# EasyEDA Pro project ProPrj_MambaQuad_2026-04-23.epro, schematic Schematic1
Board Name: Board1; Create Date: 2026-01-16; Page Name: P1; Project Name: CuteQuadUAV; Schematic Name: Schematic1; Update Date: 2026-01-16; BladeWidth: 10; Company: CQUPT; Drawed: WilliTourt; Page Size: A2; RegionStart: 1; Reviewed: WilliTourt; ShowBorder: 1; TitleBlock: 1; TitleBlockPosition: 3; Version: V1.0; XRegionCount: 6; YRegionCount: 4
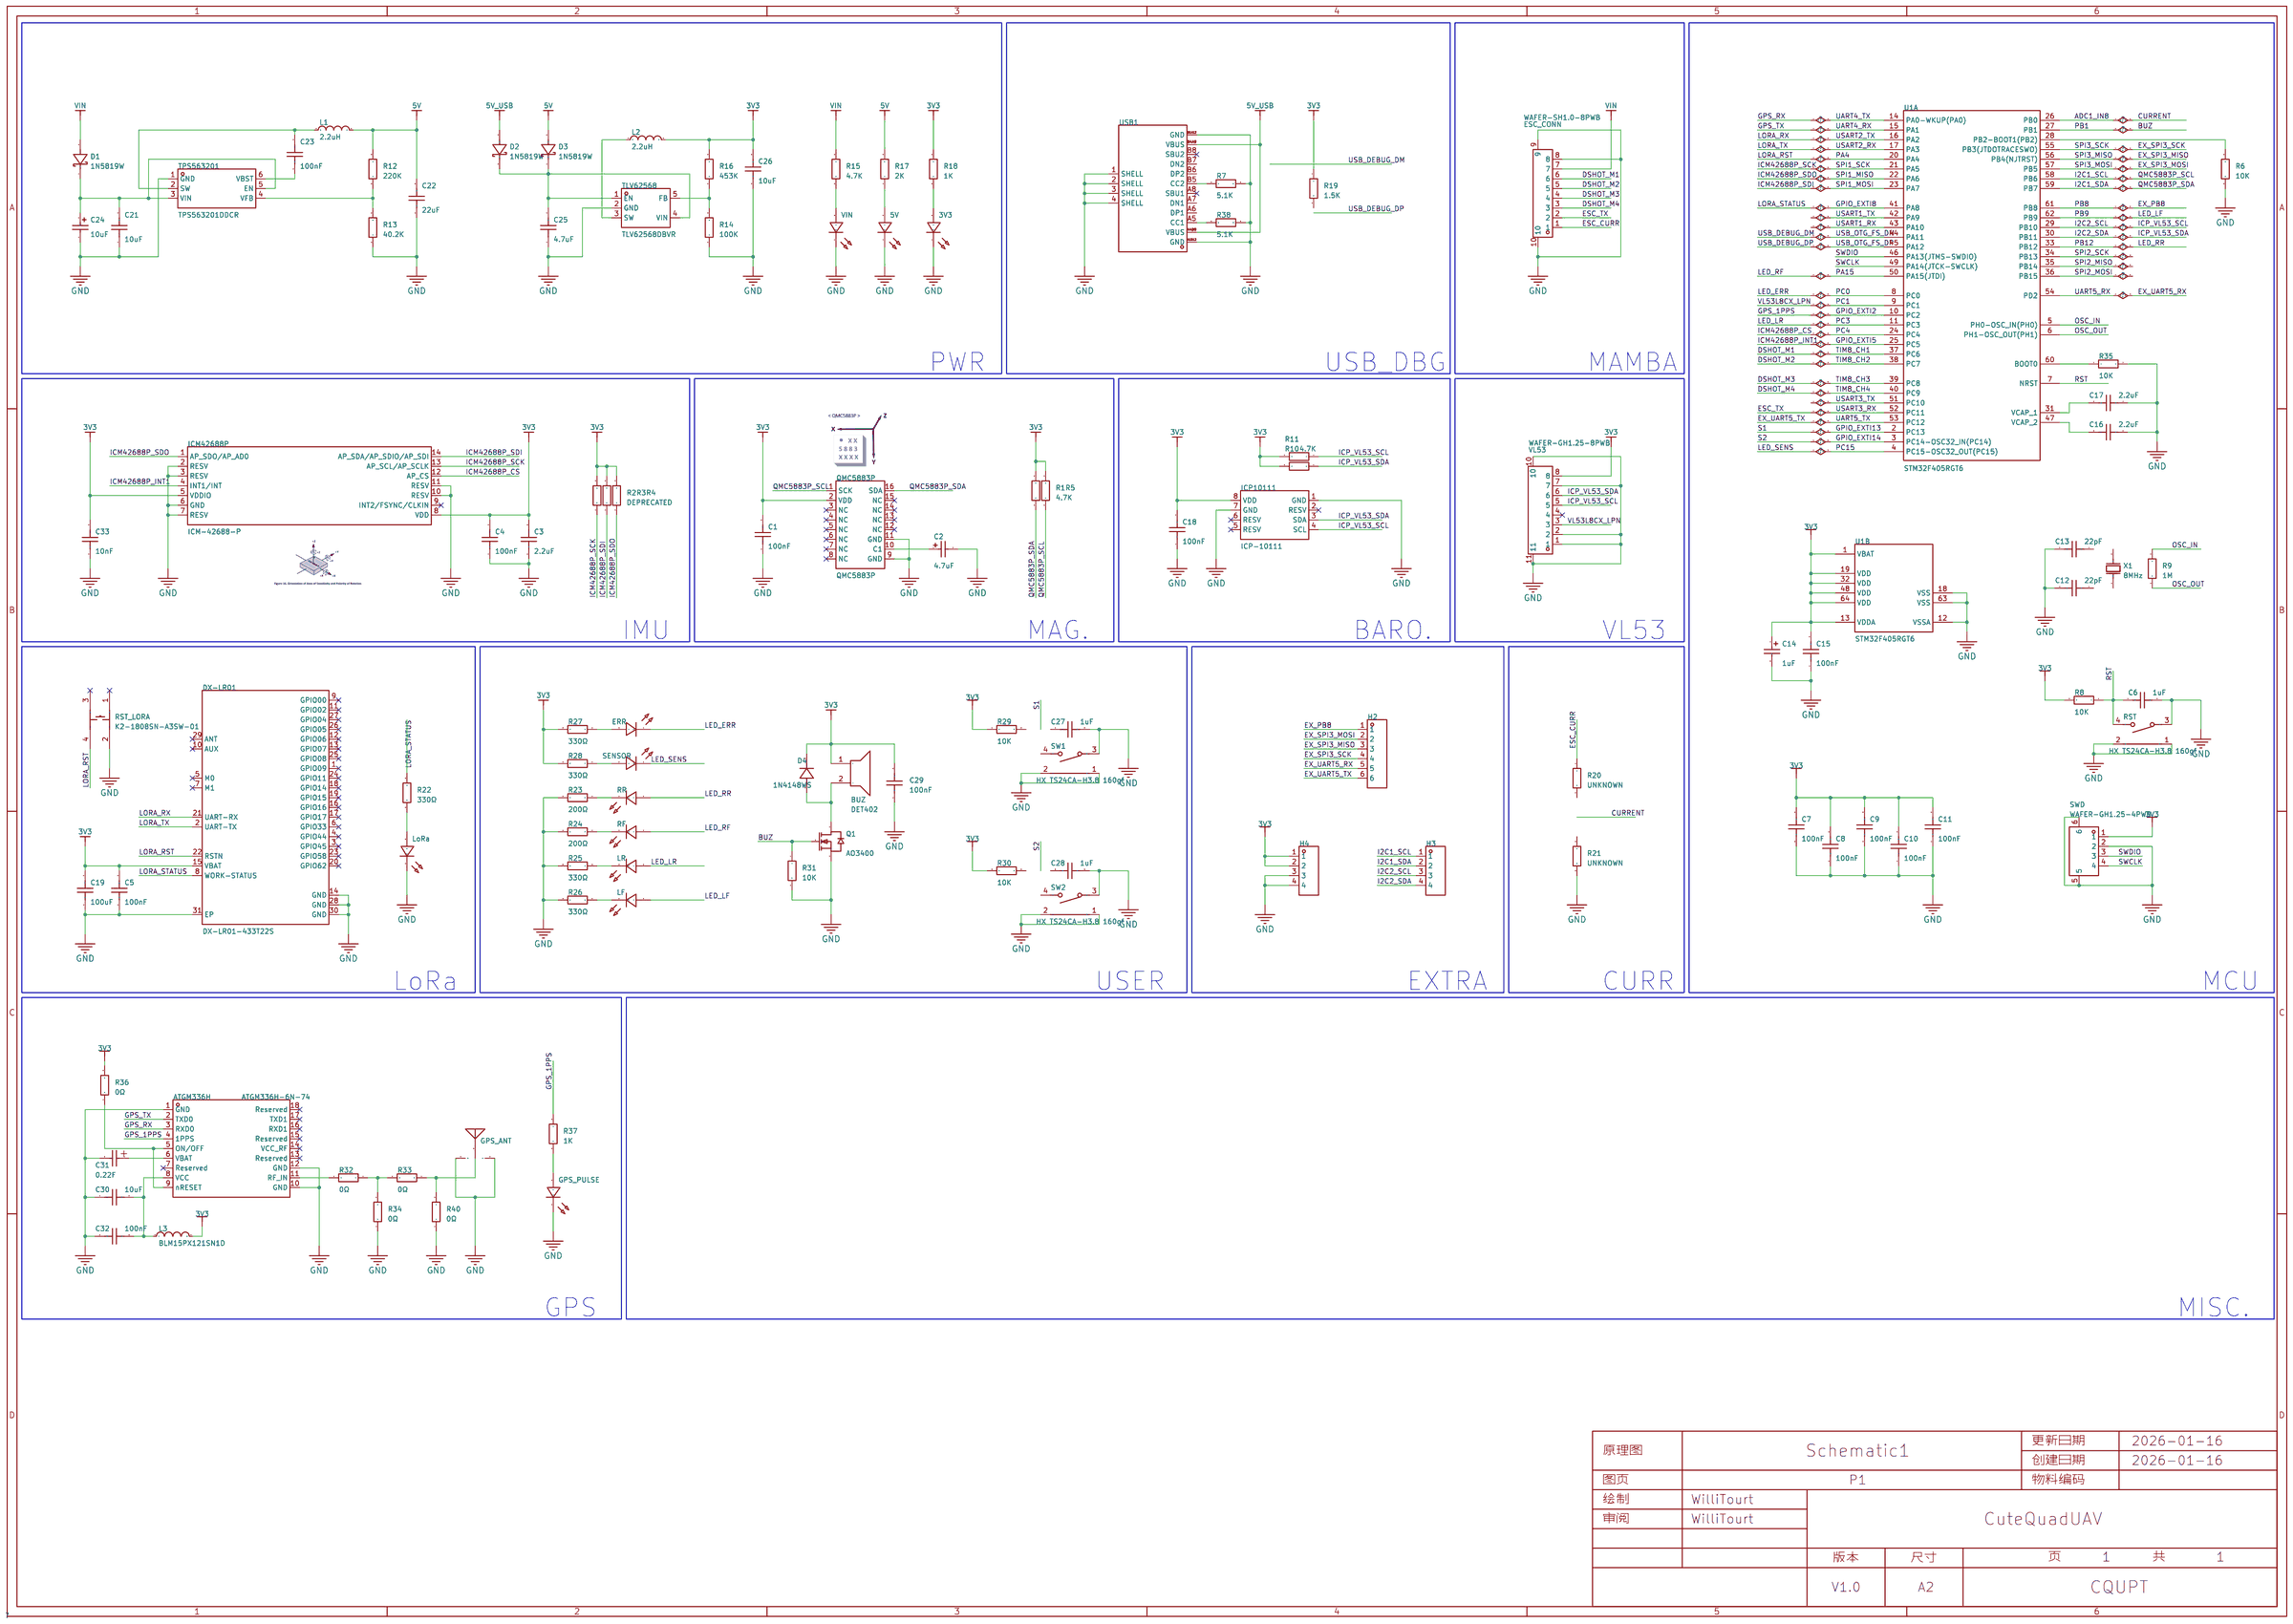
[diagram p2: schematic sheet]

## Parts
3V3  -  [LED0402]
5V  -  [LED0402]
ATGM336H  ATGM336H-6N-74  [COMM-SMD_18P-L10.1-W9.7-P1.1-TL_L76-LB]
BUZ  DET402  [BUZ-SMD_L4.0-W3.0-LS4.5-FD]
C1  100nF  [C0402]
C2  4.7uF  [CASE-A_3216]
C3  2.2uF  [C0402]
C4  100nF  [C0402]
C5  100nF  [C0603]
C6  1uF  [C0402]
C7  100nF  [C0402]
C8  100nF  [C0402]
C9  100nF  [C0402]
C10  100nF  [C0402]
C11  100nF  [C0402]
C12  22pF  [C0402]
C13  22pF  [C0402]
C14  1uF  [CASE-A_3216]
C15  100nF  [C0402]
C16  2.2uF  [C0402]
C17  2.2uF  [C0402]
C18  100nF  [C0402]
C19  100uF  [C1206]
C21  10uF  [C0603]
C22  22uF  [C0603]
C23  100nF  [C0603]
C24  10uF  [CAP-SMD_BD4.0-L4.3-W4.3-LS5.0-FD]
C25  4.7uF  [C0603]
C26  10uF  [C0603]
C27  1uF  [C0402]
C28  1uF  [C0402]
C29  100nF  [C0402]
C30  10uF  [C0603]
C31  0.22F  [CAP-TH_DMS3R3224]
C32  100nF  [C0402]
C33  10nF  [C0402]
D1  1N5819W  [SOD-123_L2.7-W1.6-LS3.7-RD]
D2  1N5819W  [SOD-123_L2.7-W1.6-LS3.7-RD]
D3  1N5819W  [SOD-123_L2.7-W1.6-LS3.7-RD]
D4  1N4148WS  [SOD-323_L1.7-W1.3-LS2.5-FD]
DX-LR01  DX-LR01-433T22S  [WIRELM-SMD_DX-LR01-433T22S]
ERR  -  [LED0402]
ESC_CONN  WAFER-SH1.0-8PWB  [CONN-SMD_8P-P1.00_XUNPU_WAFER-SH1.0-8PWB]
GPS_ANT  3GHz  [ANT-SMD_3P-L3.0-W2.6]
GPS_PULSE  -  [LED0402]
H2  -  [HDR-TH_6P-P2.54-V-F]
H3  -  [HDR-TH_4P-P2.54-V-F]
H4  -  [HDR-TH_4P-P2.54-V-F]
ICM42688P  ICM-42688-P  [LGA-14_L3.0-W2.5-P0.50-TL]
ICP10111  ICP-10111  [LGA-8_L2.5-W2.0-P0.65_AMP6127]
L1  2.2uH  [IND-SMD_L2.5-W2.0_MHCHL2520]
L2  2.2uH  [IND-SMD_L2.5-W2.0_MHCHL2520]
L3  BLM15PX121SN1D  [L0402]
LF  -  [LED0402]
LoRa  -  [LED0402]
LR  -  [LED0402]
Q1  AO3400  [SOT-23-3_L2.9-W1.3-P1.90-LS2.4-BL-2]
QMC5883P  QMC5883P  [LGA-16_L3.0-W3.0-P0.50-BL_SQ]
R1  4.7K  [R0402]
R2  DEPRECATED  [R0402]
R3  10K  [R0402]
R4  10K  [R0402]
R5  10K  [R0402]
R6  10K  [R0402]
R7  5.1K  [R0402]
R8  10K  [R0402]
R9  1M  [R0402]
R10  4.7K  [R0402]
R11  4.7K  [R0402]
R12  220K  [R0603]
R13  40.2K  [R0603]
R14  100K  [R0603]
R15  4.7K  [R0402]
R16  453K  [R0603]
R17  2K  [R0402]
R18  1K  [R0402]
R19  1.5K  [R0402]
R20  UNKNOWN  [R0402]
R21  UNKNOWN  [R0402]
R22  330Ω  [R0402]
R23  200Ω  [R0402]
R24  200Ω  [R0402]
R25  330Ω  [R0402]
R26  330Ω  [R0402]
R27  330Ω  [R0402]
R28  330Ω  [R0402]
R29  10K  [R0402]
R30  10K  [R0402]
R31  10K  [R0402]
R32  0Ω  [R0402]
R33  0Ω  [R0402]
R34  0Ω  [R0402]
R35  10K  [R0402]
R36  0Ω  [R0402]
R37  1K  [R0402]
R38  5.1K  [R0402]
R40  0Ω  [R0402]
RF  -  [LED0402]
RR  -  [LED0402]
RST  HX TS24CA-H3.8 160gf  [SW-SMD_TS24CA]
RST_LORA  K2-1808SN-A3SW-01  [SW-SMD_4P-L4.2-W3.3-P2.15-LS5.1]
SENSOR  -  [LED0402]
SW1  HX TS24CA-H3.8 160gf  [SW-SMD_TS24CA]
SW2  HX TS24CA-H3.8 160gf  [SW-SMD_TS24CA]
SWD  WAFER-GH1.25-4PWB  [CONN-SMD_4P-P1.25_XUNPU_WAFER-GH1.25-4PWB]
TLV62568  TLV62568DBVR  [SOT-23-5_L3.0-W1.7-P0.95-LS2.8-BR]
TPS563201  TPS563201DDCR  [SOT-23-6_L2.9-W1.6-P0.95-LS2.8-BR]
U1  STM32F405RGT6  [LQFP-64_L10.0-W10.0-P0.50-LS12.0-BL]  (sections 1,2)
USB1  Type-C-TOP_1  [USB-C-SMD_TYPE-C16PIN]
VIN  -  [LED0402]
VL53  WAFER-GH1.25-8PWB  [CONN-SMD_8P-P1.25_XUNPU-WAFER-GH1.25-8PWB]
X1  8MHz  [CRYSTAL-SMD_L5.0-W3.2]

## Library data of the parts
3V3 GPS_PULSE LoRa SENSOR = LED0402-WHITE
5V RF RR VIN = LED0402-GREEN
ATGM336H = ATGM336H-6N-74: ATGM336H-6N 系列模块是 10.1x9.7mm 尺寸的高性能 GNSS 全模定位导航模块系列的总称。基于中科微第六代多系统 GNSS SOC 单芯片 AT6668，支持多种卫星导航系统，包括北斗二号和北斗三号(B1I 和 B1C）、GALILEO、GPS/QZSS/SBAS、GLONASS 等，可同时接收卫星信号，实现联合定位、导航与授时。 支持同时接收全系统的卫星信号，基于专有的快速搜星技术，可快速接收大量可见卫星信号，实现快速且准确的定位，可显著改善如城市峡谷等复杂环境下的定位性能；集成高性; Supplier Part: C5804601; Manufacturer: 杭州中科微; Supplier Footprint: SMD,10.1x9.7mm; JLCPCB Part Class: 扩展库; Datasheet: https://item.szlcsc.com/datasheet/ATGM336H-6N-74/6733428.html; Supplier: LCSC
BUZ = DET402: Supplier Part: C2911630; Supplier Footprint: SMD; JLCPCB Part Class: 扩展库; Supplier: LCSC
C1 C3 C4 C6-C13 C15-C18 C27-C29 C32 C33 = C0402: Supplier Footprint: 0402
C2 = TAJA475K016RNJ: 容值:4.7uF;精度:±10%;额定电压:16V;等效串联电阻(ESR):4Ω@100kHz;; LCSC Part Name: 4.7uF ±10% 16V; Supplier Part: C7187; Manufacturer: Kyocera AVX; Supplier Footprint: CASE-A-3216-18(mm); JLCPCB Part Class: 扩展库; Supplier: LCSC; Tolerance: ±10%; Voltage Rating: 16V; Equivalent Series Resistance(ESR): 4Ω@100kHz; Operating Temperature: -55℃~+125℃
C5 C21-C23 C25 C26 C30 = C0603: Supplier Footprint: 0603
C14 = TAJA105K016RNJ: 容值:1uF;精度:±10%;额定电压:16V;等效串联电阻(ESR):11Ω;; LCSC Part Name: 1uF ±10% 16V; Supplier Part: C7174; Manufacturer: Kyocera AVX; Supplier Footprint: CASE-A-3216-18(mm); JLCPCB Part Class: 扩展库; Supplier: LCSC; Tolerance: ±10%; Voltage Rating: 16V; Equivalent Series Resistance(ESR): 11Ω; Operating Temperature: -55℃~+125℃
C19 = C1206: Supplier Footprint: 1206
C24 = VT10UF16V167RV0128: 容值:10uF;精度:±20%;额定电压:16V;纹波电流:18mA@120kHz;等效串联电阻:-;; LCSC Part Name: 10uF ±20% 16V; Supplier Part: C5246581; Manufacturer: KNSCHA(科尼盛); Supplier Footprint: SMD,D4xL5.4mm; JLCPCB Part Class: Extended Part; Datasheet: https://atta.szlcsc.com/upload/public/pdf/source/20221103/9F9BF07BB249386F3919A1DEC4ACBDCD.pdf; Supplier: LCSC; Tolerance: ±20%; Rated Voltage: 16V; Ripple Current: 18mA@120kHz; φD: 4mm; L: 5.4mm; Lifetime @ Temp: 2000hrs@105℃; Operating Temperature: -55℃~+105℃
C31 = DMS3R3224RS: 容值:0.22F;精度:-20%~+80%;额定电压:3.3V;漏电流:-;等效串联电阻(ESR):200Ω@1kHz;; LCSC Part Name: 0.22F -20%~+80% 3.3V; Supplier Part: C5110245; Manufacturer: KORCHIP(高奇普); Supplier Footprint: SMD,D6.8xL1.4mm; JLCPCB Part Class: 扩展库; Datasheet: https://atta.szlcsc.com/upload/public/pdf/source/20230629/D1B2554E63F39809F951A38373591E32.pdf; Supplier: LCSC; Tolerance: -20%~+80%; Voltage Rated: 3.3V; Equivalent Series Resistance(ESR): 200Ω@1kHz; Operating Temperature: -10℃~+60℃; Diameter: 6.8mm; Height - Seated(Max): 7.3mm
D1-D3 = 1N5819W_C963381: 二极管配置:独立式;正向压降(Vf):600mV@200mA;直流反向耐压(Vr):40V;整流电流:350mA;; LCSC Part Name: 电压:40V 电流:350mA; Supplier Part: C963381; Manufacturer: JSMSEMI(杰盛微); Supplier Footprint: SOD-123; JLCPCB Part Class: Extended Part; Datasheet: https://item.szlcsc.com/datasheet/1N5819W/1047092.html; Supplier: LCSC; Diode Configuration: 独立式; Voltage - Forward(Vf@If): 600mV@200mA; Voltage - DC Reverse(Vr): 40V; Current - Rectified: 350mA; Reverse Leakage Current (Ir): 5uA@30V; Non-Repetitive Peak Forward Surge Current: 13A
D4 = 1N4148WS_C7420319: 二极管配置:独立式;正向压降(Vf):1.25V@150mA;直流反向耐压(Vr):100V;整流电流:150mA;反向恢复时间(Trr):4ns;; Supplier Part: C7420319; Manufacturer: R+O(宏嘉诚); Supplier Footprint: SOD-323; JLCPCB Part Class: Extended Part; Datasheet: https://item.szlcsc.com/datasheet/1N4148WS/8397141.html; Supplier: LCSC; Diode Configuration: 独立式; Voltage - Forward(Vf@If): 1.25V@150mA; Voltage - DC Reverse(Vr): 100V; Current - Rectified: 150mA; Pd - Power Dissipation: 200mW; Reverse Leakage Current (Ir): 1uA@75V; Reverse Recovery Time (trr): 4ns; Operating Junction Temperature Range: -55℃~+150℃; Non-Repetitive Peak Forward Surge Current: 2A
DX-LR01 = DX-LR01-433T22S: Supplier Part: C9900235347; Supplier Footprint: SMD; Supplier: LCSC
ERR LF LR = LED0402-ORANGE
ESC_CONN = WAFER-SH1.0-8PWB: 插针结构:1x8P;间距:1mm;安装方式:卧贴;参考系列:SH;总PIN数:8P;排数:1;每排PIN数:8;行距:-;额定电流:1A;触头材质:黄铜;触头镀层:锡;工作温度:-40℃~+85℃;; LCSC Part Name: 1x8P 间距:1mm 卧贴 系列:SH; Supplier Part: C3029347; Manufacturer: XUNPU(讯普); Supplier Footprint: SMD,P=1mm,卧贴; JLCPCB Part Class: Extended Part; Datasheet: https://item.szlcsc.com/datasheet/WAFER-SH1.0-8PWB/3561359.html; Supplier: LCSC; Pins Structure: 1x8P; Pitch: 1mm; Mounting Type: 卧贴; Reference Series: SH; Number of Pins: 8P; Number of Rows: 1; Number of PINs Per Row: 8; Current Rating: 1A; Contact Material: 黄铜; Contact Plating: 锡; Operating Temperature: -40℃~+85℃; Voltage Rating: 50V; Plastic Material: LCP; Supplementary Features: 辅助焊脚; Color: 米色; Z-Height of the Board: 3.15mm; X-Length of Bottom Edge on Board (Spacing Line): 10.35mm; Y-Width of Bottom Edge on Board: 4.3mm
GPS_ANT = IPEX1-TXZ 142: 连接器类型:板端;接口类型:内针;端口数量:1;接口直径:2mm;接口长度/高度:1.25mm;频率:3GHz;射频系列:IPEX;阻抗:-;样式:-;工作温度:-40℃~+90℃;; LCSC Part Name: 内针 IPEX; Supplier Part: C3151745; Manufacturer: SHOU HAN(首韩); Supplier Footprint: SMD; JLCPCB Part Class: 扩展库; Datasheet: https://item.szlcsc.com/datasheet/IPEX1-TXZ%2520142/3712563.html; Supplier: LCSC; Connector Type: 板端; Interface: 内针; Number of Ports: 1; Interface Diameter: 2mm; Interface Length/Height: 1.25mm; RF Series: IPEX; Operating Temperature Range: -40℃~+90℃
H2 = HDR-F_2.54_1x6P: Supplier Part: C40877; Supplier Footprint: 插件
H3 H4 = HDR-F_2.54_1x4P: Supplier Part: C2718488; Supplier Footprint: 插件
ICM42688P = ICM-42688-P: 传感器类型:加速度计陀螺仪;; Supplier Part: C1850418; Manufacturer: TDK InvenSense(应美盛); Supplier Footprint: LGA-14(2.5x3); JLCPCB Part Class: 扩展库; Datasheet: https://atta.szlcsc.com/upload/public/pdf/source/20210703/CF24204867ACE5B754A2B035F23E5931.pdf; Supplier: LCSC; Sensor Type: 加速度计陀螺仪
ICP10111 = ICP-10111: 压力范围:30Kpa~110Kpa;; Supplier Part: C5772344; Manufacturer: TDK InvenSense(应美盛); Supplier Footprint: LGA-8(2x2.5); JLCPCB Part Class: Extended Part; Datasheet: https://item.szlcsc.com/datasheet/ICP-10111/6699212.html; Supplier: LCSC; Pressure range: 30Kpa~110Kpa; Voltage - Supply: 1.8V; Operating Temperature: -40℃~+85℃
L1 L2 = FTC252012S2R2MBCA: 电感值:2.2uH;精度:±20%;额定电流:3A;饱和电流(Isat):3.8A;类型:一体成型电感;; LCSC Part Name: 2.2uH ±20% 3.8A; Supplier Part: C5832372; Manufacturer: cjiang(长江微电); Supplier Footprint: 1008; JLCPCB Part Class: Extended Part; Datasheet: https://atta.szlcsc.com/upload/public/pdf/source/20230602/8FFEDA9C0247A92A0D4B67554BFE4091.pdf; Supplier: LCSC; Tolerance: ±20%; Rated Current: 3A; Saturation Current (Isat): 3.8A; DC Resistance (DCR): 55mΩ; Type: 一体成型电感
L3 = BLM15PX121SN1D: 阻抗@频率:120Ω@100MHz;误差:±25%;直流电阻(DCR):55mΩ;; LCSC Part Name: 单路 0402磁珠 阻抗120Ω@100MHz; Supplier Part: C88970; Manufacturer: muRata(村田); Supplier Footprint: 0402; JLCPCB Part Class: Extended Part; Datasheet: https://item.szlcsc.com/datasheet/BLM15PX121SN1D/90150.html; Supplier: LCSC; Impedance @ Frequency: 120Ω@100MHz; Tolerance: ±25%; DC Resistance(DCR): 55mΩ; Current Rating: 2A; Number of Circuits: 1; Operating Temperature: -55℃~+125℃
Q1 = AO3400: Supplier Part: C9900013365; Supplier Footprint: SOT-23; JLCPCB Part Class: 扩展库; Supplier: LCSC
QMC5883P = QMC5883P: QMC5883L停产，推荐使用 C2847467 QMC5883P替代; LCSC Part Name: 三轴磁传感器; Supplier Part: C2847467; Manufacturer: QST(上海矽睿); Supplier Footprint: LGA-16(3x3); JLCPCB Part Class: 扩展库; Datasheet: https://item.szlcsc.com/datasheet/QMC5883P/3044607.html; Supplier: LCSC
R1-R11 R15 R17-R38 R40 = R0402: Supplier Footprint: 0402
R12-R14 R16 = R0603: Supplier Footprint: 0603
RST SW1 SW2 = HX TS24CA-H3.8 160gf: 电路结构:单刀单掷;按钮形状:方形按钮;作用力:1.6N;安装方式:卧贴;开关长度:4.55mm;开关宽度:1.8mm;开关高度:3.8mm;带支架:不带支架;触点电流:50mA;额定电压:12V;带灯:无;工作寿命:2万次;; LCSC Part Name: 轻触开关2.3x4.7x3.8侧贴160gf带固定柱; Supplier Part: C25168830; Manufacturer: hanxia(韩下); Supplier Footprint: SMD-4P,4.6x1.8mm; JLCPCB Part Class: Extended Part; Datasheet: https://item.szlcsc.com/datasheet/HX%2520TS24CA-H3.8%2520160gf/26898572.html; Supplier: LCSC; Circuit: 单刀单掷; Actuator Style: 方形按钮; Operating Force: 1.6N; Mounting Type: 卧贴; Length: 4.55mm; Width: 1.8mm; Switch Height: 3.8mm; with Bracket: 不带支架; Contact Current: 50mA; Voltage Rating: 12V; Actuator/Cap Color: 黑色; With Lamp: 无; Termination Style: SMD接片; Life: 2万次; Operating Temperature: -25℃~+70℃
RST_LORA = K2-1808SN-A3SW-01: 作用力:180gf;安装方式:立贴;开关长度:4.2mm;开关宽度:3.25mm;开关高度:2.5mm;触点电流:50mA;额定电压(DC):12V;绝缘电阻:100MΩ;机械寿命:10万次;; LCSC Part Name: 3*4*2.5 贴片开关180G; Supplier Part: C2690012; Manufacturer: 韩国韩荣; Supplier Footprint: SMD; JLCPCB Part Class: 扩展库; Datasheet: https://atta.szlcsc.com/upload/public/pdf/source/20180927/C283535_7E7907F3E7B6C1691E1DC87E363D082A.pdf; Supplier: LCSC; Operating Force: 180gf; Mounting Style: 立贴; Switch Length: 4.2mm; Switch Width: 3.25mm; Switch Height: 2.5mm; Contact Current: 50mA; Voltage Rating (DC): 12V; Insulation Resistance: 100MΩ; Mechanical Life: 10万次; Operating Temperature: -25℃~+85℃
SWD = WAFER-GH1.25-4PWB: 插针结构:1x4P;间距:1.25mm;安装方式:卧贴;参考系列:GH;总PIN数:4P;排数:1;每排PIN数:4;行距:-;额定电流:1A;触头材质:黄铜;触头镀层:锡;工作温度:-25℃~+85℃;; LCSC Part Name: 1x4P 间距:1.25mm 卧贴 系列:GH; Supplier Part: C3029379; Manufacturer: XUNPU(讯普); Supplier Footprint: SMD,P=1.25mm,卧贴; JLCPCB Part Class: Extended Part; Datasheet: https://item.szlcsc.com/datasheet/WAFER-GH1.25-4PWB/3561391.html; Supplier: LCSC; Pins Structure: 1x4P; Pitch: 1.25mm; Mounting Type: 卧贴; Reference Series: GH; Number of Pins: 4P; Number of Rows: 1; Number of PINs Per Row: 4; Current Rating: 1A; Contact Material: 黄铜; Contact Plating: 锡; Operating Temperature: -25℃~+85℃; Voltage Rating: 125V; Plastic Material: LCP; Supplementary Features: 辅助焊脚; Color: 米色; Z-Height of the Board: 4.35mm; X-Length of Bottom Edge on Board (Spacing Line): 8.25mm; Y-Width of Bottom Edge on Board: 5mm
TLV62568 = TLV62568DBVR: 功能类型:降压型;输出类型:可调;工作电压:2.5V~5.5V;输出电压:600mV~5.5V;输出电流:1A;; LCSC Part Name: 1A高效同步降压转换器; Supplier Part: C163219; Manufacturer: TI(德州仪器); Supplier Footprint: SOT-23-5; JLCPCB Part Class: 扩展库; Datasheet: https://www.ti.com/cn/lit/gpn/tlv62568; Supplier: LCSC; Function: 降压型; Output Type: 可调; Input Voltage: 2.5V~5.5V; Output Voltage: 600mV~5.5V; Output Current: 1A; Switching Frequency: 1.5MHz; Operating Temperature: -40℃~+125℃@(TJ); Synchronous Rectification: 是; Number of Outputs: 1; Topology: 降压式; Switch tube (built-in/external): 内置
TPS563201 = TPS563201DDCR: 功能类型:降压型;输出类型:可调;工作电压:4.5V~17V;输出电压:768mV~7V;输出电流:3A;; LCSC Part Name: 4.5V至17V输入，3A同步降压电压调节器; Supplier Part: C116592; Manufacturer: TI(德州仪器); Supplier Footprint: SOT-23-THIN-6; JLCPCB Part Class: Extended Part; Datasheet: https://item.szlcsc.com/datasheet/TPS563201DDCR/117846.html; Supplier: LCSC; Function: 降压型; Output Type: 可调; Voltage - Supply: 4.5V~17V; Output Voltage: 768mV~7V; Output Current: 3A; Frequency - Switching: 580kHz; Operating Temperature: -40℃~+125℃@(TJ); Synchronous Rectifier: 是; Number of Outputs: 1; Topology: 降压式; Switch tube (built-in/external): 内置
U1 = STM32F405RGT6: CPU内核:ARM-M4;CPU最大主频:168MHz;应用领域:-;; LCSC Part Name: 带DSP和FPU的高性能基础系列ARM Cortex-M4 MCU，具有1 MB Flash、168 MHz CPU和ART加速器; Supplier Part: C15742; Manufacturer: ST(意法半导体); Supplier Footprint: LQFP-64(10x10); JLCPCB Part Class: 扩展库; Datasheet: https://item.szlcsc.com/datasheet/STM32F405RGT6/16424.html; Supplier: LCSC; CPU Core: ARM-M4; CPU Maximum Speed: 168MHz; Program Storage Size: 1MB; Program Memory Type: FLASH; Number of I/O: 51; ADC (Bit): 12bit; DAC (Bit): 12bit; Voltage - Supply: 1.8V~3.6V
USB1 = Type-C-TOP_1: Supplier Part: C9900005857; Supplier Footprint: Type-C16P; JLCPCB Part Class: 扩展库; Supplier: LCSC; Check: false
VL53 = WAFER-GH1.25-8PWB: 插针结构:1x8P;间距:1.25mm;安装方式:卧贴;参考系列:GH;总PIN数:8P;排数:1;每排PIN数:8;行距:-;额定电流:1A;触头材质:黄铜;触头镀层:锡;工作温度:-25℃~+85℃;; LCSC Part Name: 1x8P 间距:1.25mm 卧贴 系列:GH; Supplier Part: C3029383; Manufacturer: XUNPU(讯普); Supplier Footprint: SMD,P=1.25mm,卧贴; JLCPCB Part Class: Extended Part; Datasheet: https://item.szlcsc.com/datasheet/WAFER-GH1.25-8PWB/3561395.html; Supplier: LCSC; Pins Structure: 1x8P; Pitch: 1.25mm; Mounting Type: 卧贴; Reference Series: GH; Number of Pins: 8P; Number of Rows: 1; Number of PINs Per Row: 8; Current Rating: 1A; Contact Material: 黄铜; Contact Plating: 锡; Operating Temperature: -25℃~+85℃; Voltage Rating: 125V; Plastic Material: LCP; Supplementary Features: 辅助焊脚; Color: 米色; Z-Height of the Board: 4.35mm; X-Length of Bottom Edge on Board (Spacing Line): 13.25mm; Y-Width of Bottom Edge on Board: 5mm
X1 = X50328MSB2GI: 晶振类型:贴片晶振;频率:8MHz;常温频差:±10ppm;外接负载电容:20pF;频率稳定度(全温):±20ppm;; LCSC Part Name: 8MHz ±10ppm 20pF YSX530GA; Supplier Part: C115962; Manufacturer: YXC(扬兴晶振); Supplier Footprint: SMD5032; JLCPCB Part Class: 基础库; Datasheet: https://atta.szlcsc.com/upload/public/pdf/source/20240329/44922B0AF7B60E58E9B66993B6077277.pdf; Supplier: LCSC; Crystal Type: 贴片晶振; Normal temperature Frequency Tolerance: ±10ppm; External load capacitor: 20pF; Frequency Stability(Full temperature range): ±20ppm; Operating Temperature: -40℃~+85℃

## Nets
3V3: BUZ.1(+) C1.2 C3.2 C4.2 C5.2 C7.2 C8.2 C9.2 C10.2 C11.2 C14.1 C15.2 C18.2 C19.2 C26.2 C29.2 C33.2 D4.2(K) DX-LR01.15(VBAT) H4.1 H4.2 ICM42688P.5(VDDIO) ICM42688P.8(VDD) ICP10111.8(VDD) L2.2 L3.2 QMC5883P.2(VDD) R1.2 R2.2 R3.2 R4.2 R5.2 R8.2 R10.2 R11.2 R16.2 R18.1 R19.1 R27.2 R28.2 R29.1 R30.1 R36.2 SWD.1 U1.1(VBAT) U1.13(VDDA) U1.19(VDD) U1.32(VDD) U1.48(VDD) U1.64(VDD) VL53.8
5V: C22.2 D3.2(A) L1.2 R12.2 R17.2
5V_USB: D2.2(A) USB1.A4B9(VBUS) USB1.B4A9(VBUS)
GND: 3V3.1(C) 5V.1(C) ATGM336H.1(GND) ATGM336H.10(GND) ATGM336H.12(GND) C1.1 C2.2 C3.1 C4.1 C5.1 C6.2 C7.1 C8.1 C9.1 C10.1 C11.1 C12.2 C13.2 C14.2 C15.1 C16.1 C17.1 C18.1 C19.1 C21.1 C22.1 C24.2 C25.1 C26.1 C27.2 C28.2 C29.1 C30.1 C31.2 C32.1 C33.1 DX-LR01.14(GND) DX-LR01.28(GND) DX-LR01.30(GND) DX-LR01.31(EP) ESC_CONN.8 ESC_CONN.9 ESC_CONN.10 GPS_ANT.2 GPS_ANT.3 GPS_PULSE.1(C) H4.3 H4.4 ICM42688P.2(RESV) ICM42688P.3(RESV) ICM42688P.6(GND) ICM42688P.7(RESV) ICM42688P.10(RESV) ICM42688P.11(RESV) ICP10111.1(GND) ICP10111.7(GND) LoRa.1(C) Q1.2(S) QMC5883P.9(GND) QMC5883P.11(GND) R6.2 R7.2 R13.1 R14.1 R21.2 R23.2 R24.2 R25.2 R26.2 R31.2 R34.1 R35.2 R38.1 R40.1 RST.1 RST.2 RST.3 RST_LORA.2 SW1.1 SW1.2 SW1.3 SW2.1 SW2.2 SW2.3 SWD.2 SWD.5 SWD.6 TLV62568.2(GND) TPS563201.1(GND) U1.12(VSSA) U1.18(VSS) U1.63(VSS) USB1.1(SHELL) USB1.2(SHELL) USB1.3(SHELL) USB1.4(SHELL) USB1.A1B12(GND) USB1.B1A12(GND) VIN.1(C) VL53.1 VL53.2 VL53.7 VL53.10 VL53.11
VIN: D1.2(A) ESC_CONN.7 R15.1
ADC1_IN8: R20.2 R21.1 U1.26(PB0)
BUZ: Q1.1(G) R31.1 U1.27(PB1)
DSHOT_M1: ESC_CONN.6 U1.37(PC6)
DSHOT_M2: ESC_CONN.5 U1.38(PC7)
DSHOT_M3: ESC_CONN.4 U1.39(PC8)
DSHOT_M4: ESC_CONN.3 U1.40(PC9)
ESC_CURR: ESC_CONN.1 R20.1
ESC_TX: ESC_CONN.2 U1.52(PC11)
EX_PB8: H2.1 U1.61(PB8)
EX_SPI3_MISO: H2.3 U1.56(PB4(NJTRST))
EX_SPI3_MOSI: H2.2 U1.57(PB5)
EX_SPI3_SCK: H2.4 U1.55(PB3(JTDOTRACESWO))
EX_UART5_RX: H2.5 U1.54(PD2)
EX_UART5_TX: H2.6 U1.53(PC12)
GPIO_EXTI2: ATGM336H.4(1PPS) R37.1 U1.10(PC2)
GPIO_EXTI5: ICM42688P.4(INT1/INT) U1.25(PC5)
GPIO_EXTI8: DX-LR01.8(WORK-STATUS) R22.1 U1.41(PA8)
GPIO_EXTI13: C27.1 R29.2 SW1.4 U1.2(PC13)
GPIO_EXTI14: C28.1 R30.2 SW2.4 U1.3(PC14-OSC32_IN(PC14))
GPS_RX: ATGM336H.3(RXD0) U1.14(PA0-WKUP(PA0))
GPS_TX: ATGM336H.2(TXD0) U1.15(PA1)
I2C1_SCL: H3.1 QMC5883P.1(SCK) R5.1 U1.58(PB6)
I2C1_SDA: H3.2 QMC5883P.16(SDA) R1.1 U1.59(PB7)
I2C2_SCL: H3.3 ICP10111.4(SCL) R11.1 U1.29(PB10) VL53.5
I2C2_SDA: H3.4 ICP10111.3(SDA) R10.1 U1.30(PB11) VL53.6
ICM42688P_CS: ICM42688P.12(AP_CS) U1.24(PC4)
ICM42688P_SCK: ICM42688P.13(AP_SCL/AP_SCLK) R2.1 U1.21(PA5)
ICM42688P_SDI: ICM42688P.14(AP_SDA/AP_SDIO/AP_SDI) R3.1 U1.23(PA7)
ICM42688P_SDO: ICM42688P.1(AP_SDO/AP_AD0) R4.1 U1.22(PA6)
LED_ERR: ERR.1(C) U1.8(PC0)
LED_LF: LF.2(A) U1.62(PB9)
LED_LR: LR.2(A) U1.11(PC3)
LED_RF: RF.2(A) U1.50(PA15(JTDI))
LED_RR: RR.2(A) U1.33(PB12)
LED_SENS: SENSOR.1(C) U1.4(PC15-OSC32_OUT(PC15))
LORA_RST: DX-LR01.22(RSTN) RST_LORA.4 U1.20(PA4)
LORA_RX: DX-LR01.21(UART-RX) U1.16(PA2)
LORA_TX: DX-LR01.2(UART-TX) U1.17(PA3)
OSC_IN: C13.1 R9.1 U1.5(PH0-OSC_IN(PH0)) X1.2(OSC2)
OSC_OUT: C12.1 R9.2 U1.6(PH1-OSC_OUT(PH1)) X1.1(OSC1)
PC1: U1.9(PC1) VL53.3
RST: C6.1 R8.1 RST.4 U1.7(NRST)
SPI2_MISO: U1.35(PB14)
SPI2_MOSI: U1.36(PB15)
SPI2_SCK: U1.34(PB13)
SWCLK: SWD.4 U1.49(PA14(JTCK-SWCLK))
SWDIO: SWD.3 U1.46(PA13(JTMS-SWDIO))
USART1_RX: U1.43(PA10)
USART1_TX: U1.42(PA9)
USART3_TX: U1.51(PC10)
USB_DEBUG_DM: U1.44(PA11) USB1.A7(DN1) USB1.B7(DN2)
USB_DEBUG_DP: R19.2 U1.45(PA12) USB1.A6(DP1) USB1.B6(DP2)
$1N125: R15.2 VIN.2(A)
$1N141: 3V3.2(A) R18.2
$1N356: BUZ.2(-) D4.1(A) Q1.3(D)
$1N378: ATGM336H.6(VBAT) C31.1
$1N390: ATGM336H.5(ON/OFF) ATGM336H.9(nRESET) R36.1
$1N391: ATGM336H.8(VCC) C30.2 C32.2 L3.1
$1N446: ERR.2(A) R27.1
$1N450: LF.1(C) R26.1
$1N451: LR.1(C) R25.1
$1N452: R24.1 RF.1(C)
$1N453: R23.1 RR.1(C)
Net-(5V-2): 5V.2(A) R17.1
Net-(ATGM336H-11): ATGM336H.11(RF_IN) R32.2
Net-(C2-1): C2.1 QMC5883P.10(C1)
Net-(C16-2): C16.2 U1.47(VCAP_2)
Net-(C17-2): C17.2 U1.31(VCAP_1)
Net-(C21-2): C21.2 C24.1 D1.1(C) TPS563201.3(VIN) TPS563201.5(EN)
Net-(C23-1): C23.1 TPS563201.6(VBST)
Net-(C23-2): C23.2 L1.1 TPS563201.2(SW)
Net-(C25-2): C25.2 D2.1(C) D3.1(C) TLV62568.1(EN) TLV62568.4(VIN)
Net-(GPS_ANT-1): GPS_ANT.1 R33.1 R40.2
Net-(GPS_PULSE-2): GPS_PULSE.2(A) R37.2
Net-(L2-1): L2.1 TLV62568.3(SW)
Net-(LoRa-2): LoRa.2(A) R22.2
Net-(R6-1): R6.1 U1.28(PB2-BOOT1(PB2))
Net-(R7-1): R7.1 USB1.B5(CC2)
Net-(R12-1): R12.1 R13.2 TPS563201.4(VFB)
Net-(R14-2): R14.2 R16.1 TLV62568.5(FB)
Net-(R28-1): R28.1 SENSOR.2(A)
Net-(R32-1): R32.1 R33.2 R34.2
Net-(R35-1): R35.1 U1.60(BOOT0)
Net-(R38-2): R38.2 USB1.A5(CC1)

Not connected (* = marked no-connect by the designer): ATGM336H 7(Reserved)* 13(Reserved)* 14(VCC_RF)* 15(Reserved)* 16(RXD1)* 17(TXD1)* 18(Reserved)*; DX-LR01 1(GPIO09)* 3(GPIO45)* 4(GPIO44)* 5(M0)* 6(GPIO33)* 7(M1)* 9(GPIO00)* 10(AUX)* 11(GPIO02)* 12(GPIO06)* 13(GPIO07)* 16(GPIO16)* 17(GPIO17)* 18(GPIO14)* 19(GPIO15)* 20(GPIO62)* 23(GPIO58)* 24(GPIO11)* 25(GPIO08)* 26(GPIO05)* 27(GPIO04)* 29(ANT)*; ICM42688P 9(INT2/FSYNC/CLKIN)*; ICP10111 2(RESV)* 5(RESV)* 6(RESV)*; QMC5883P 3(NC)* 4(NC)* 5(NC)* 6(NC)* 7(NC)* 8(NC)* 12(NC)* 13(NC)* 14(NC)* 15(NC)*; RST_LORA 1* 3*; USB1 A8(SBU1)* B8(SBU2)*; VL53 4*

## Notes on the sheet
- PWR
- USB_DBG
- MAMBA
- IMU
- MAG.
- BARO.
- VL53
- LoRa
- USER
- EXTRA
- CURR
- MCU
- GPS
- MISC.
